# EAGLE schematic proto_secondaire (EAGLE 6.1)
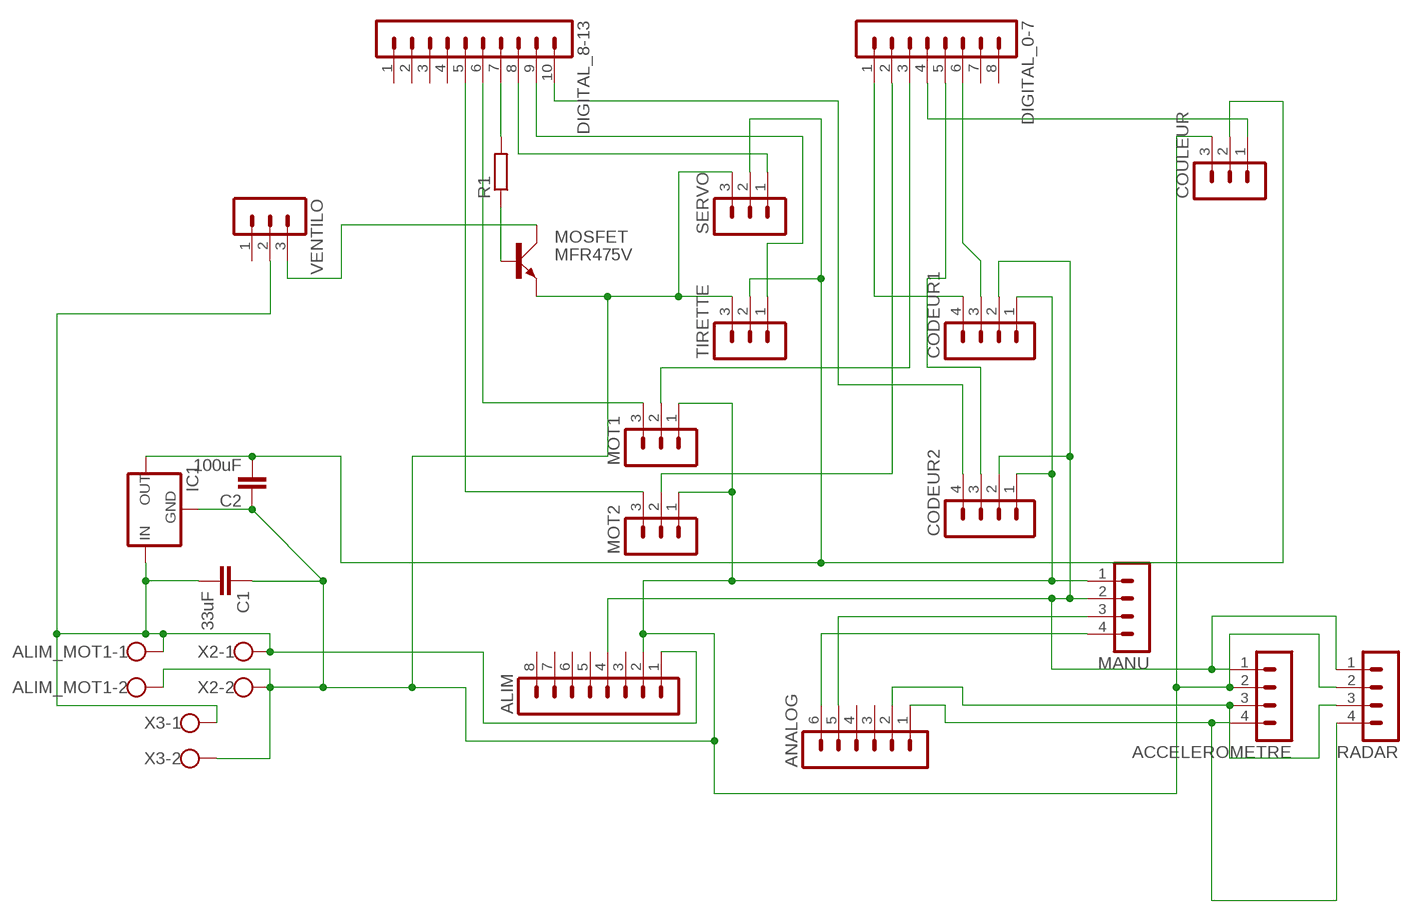
[diagram p0: schematic, sheet 1]

## Parts
ACCELEROMETRE  MA04-1  [MA04-1]
ALIM  MA08-1  [MA08-1]
ALIM_MOT1  W237-102  [W237-102]
ANALOG  MA06-1  [MA06-1]
C1  33uF  C5/5  [C5B5]
C2  100uF  C5/5  [C5B5]
CODEUR1  MA04-1  [MA04-1]
CODEUR2  MA04-1  [MA04-1]
COULEUR  MA03-1  [MA03-1]
DIGITAL_0-7  MA08-1  [MA08-1]
DIGITAL_8-13  MA10-1  [MA10-1]
IC1  78XXS  [78XXS]
MANU  MA04-1  [MA04-1]
MOSFET  MFR475V  [TO220AV]
MOT1  MA03-1  [MA03-1]
MOT2  MA03-1  [MA03-1]
R1  R-EU_0204/5  [0204/5]
RADAR  MA04-1  [MA04-1]
SERVO  MA03-1  [MA03-1]
TIRETTE  MA03-1  [MA03-1]
VENTILO  MA03-1  [MA03-1]
X2  W237-102  [W237-102]
X3  W237-102  [W237-102]

## Nets
CODEUR2_ETAT: CODEUR2.3 DIGITAL_0-7.5
N$1: CODEUR1.4 DIGITAL_0-7.1
N$2: ANALOG.5 MANU.3
N$4: CODEUR2.4 DIGITAL_8-13.10
N$5: CODEUR1.3 DIGITAL_0-7.6
N$6: DIGITAL_0-7.2 MOT2.2
N$7: DIGITAL_8-13.5 MOT2.3
N$8: DIGITAL_0-7.3 MOT1.2
N$9: DIGITAL_8-13.6 MOT1.3
N$11: MOSFET.B R1.1
N$12: DIGITAL_8-13.7 R1.2
N$13: ANALOG.6 MANU.4
N$14: ALIM.1 ALIM_MOT1.1 C1.2 IC1.IN VENTILO.2 X2.1 X3.1
N$15: MOSFET.C VENTILO.3
N$16: COULEUR.1 DIGITAL_0-7.4
N$17: DIGITAL_8-13.8 SERVO.1
N$18: DIGITAL_8-13.9 TIRETTE.1
N$19: C2.2 COULEUR.2 IC1.OUT SERVO.2 TIRETTE.2
N$20: ACCELEROMETRE.2 ALIM.2 ALIM_MOT1.2 C1.1 C2.1 CODEUR1.1 CODEUR2.1 COULEUR.3 IC1.GND MANU.1 MOSFET.E MOT1.1 MOT2.1 RADAR.2 SERVO.3 TIRETTE.3 X2.2 X3.2
N$21: ACCELEROMETRE.4 ANALOG.1 RADAR.4
N$22: ACCELEROMETRE.3 ANALOG.2 RADAR.3
N$27: ACCELEROMETRE.1 ALIM.4 CODEUR1.2 CODEUR2.2 MANU.2 RADAR.1
Unconnected: ALIM.3 ALIM.5 ALIM.6 ALIM.7 ALIM.8 ANALOG.3 ANALOG.4 DIGITAL_0-7.7 DIGITAL_0-7.8 DIGITAL_8-13.1 DIGITAL_8-13.2 DIGITAL_8-13.3 DIGITAL_8-13.4 VENTILO.1

## Library data of the parts
ACCELEROMETRE CODEUR1 CODEUR2 MANU RADAR = con-lstb:MA04-1: PIN HEADER; OC_FARNELL: unknown; OC_NEWARK: unknown
ALIM DIGITAL_0-7 = con-lstb:MA08-1: PIN HEADER; OC_FARNELL: unknown; OC_NEWARK: unknown
ALIM_MOT1 X2 X3 = con-wago-500:W237-102: WAGO SCREW CLAMP; MPN: 237-102; OC_FARNELL: unknown; OC_NEWARK: 70K9898
ANALOG = con-lstb:MA06-1: PIN HEADER; OC_FARNELL: unknown; OC_NEWARK: unknown
C1 C2 = capacitor-wima:C: CAPACITOR naming: grid - package width
COULEUR MOT1 MOT2 SERVO TIRETTE VENTILO = con-lstb:MA03-1: PIN HEADER; OC_FARNELL: unknown; OC_NEWARK: unknown
DIGITAL_8-13 = con-lstb:MA10-1: PIN HEADER; OC_FARNELL: unknown; OC_NEWARK: unknown
IC1 = v-reg:78XXS: VOLTAGE REGULATOR
MOSFET = transistor-power:MFR4*: NPN RF Power Transistor Source: Motorola - MRF475.pdf
R1 = resistor:R-EU_: RESISTOR, European symbol